# EAGLE schematic Rable (EAGLE 9.6.1)
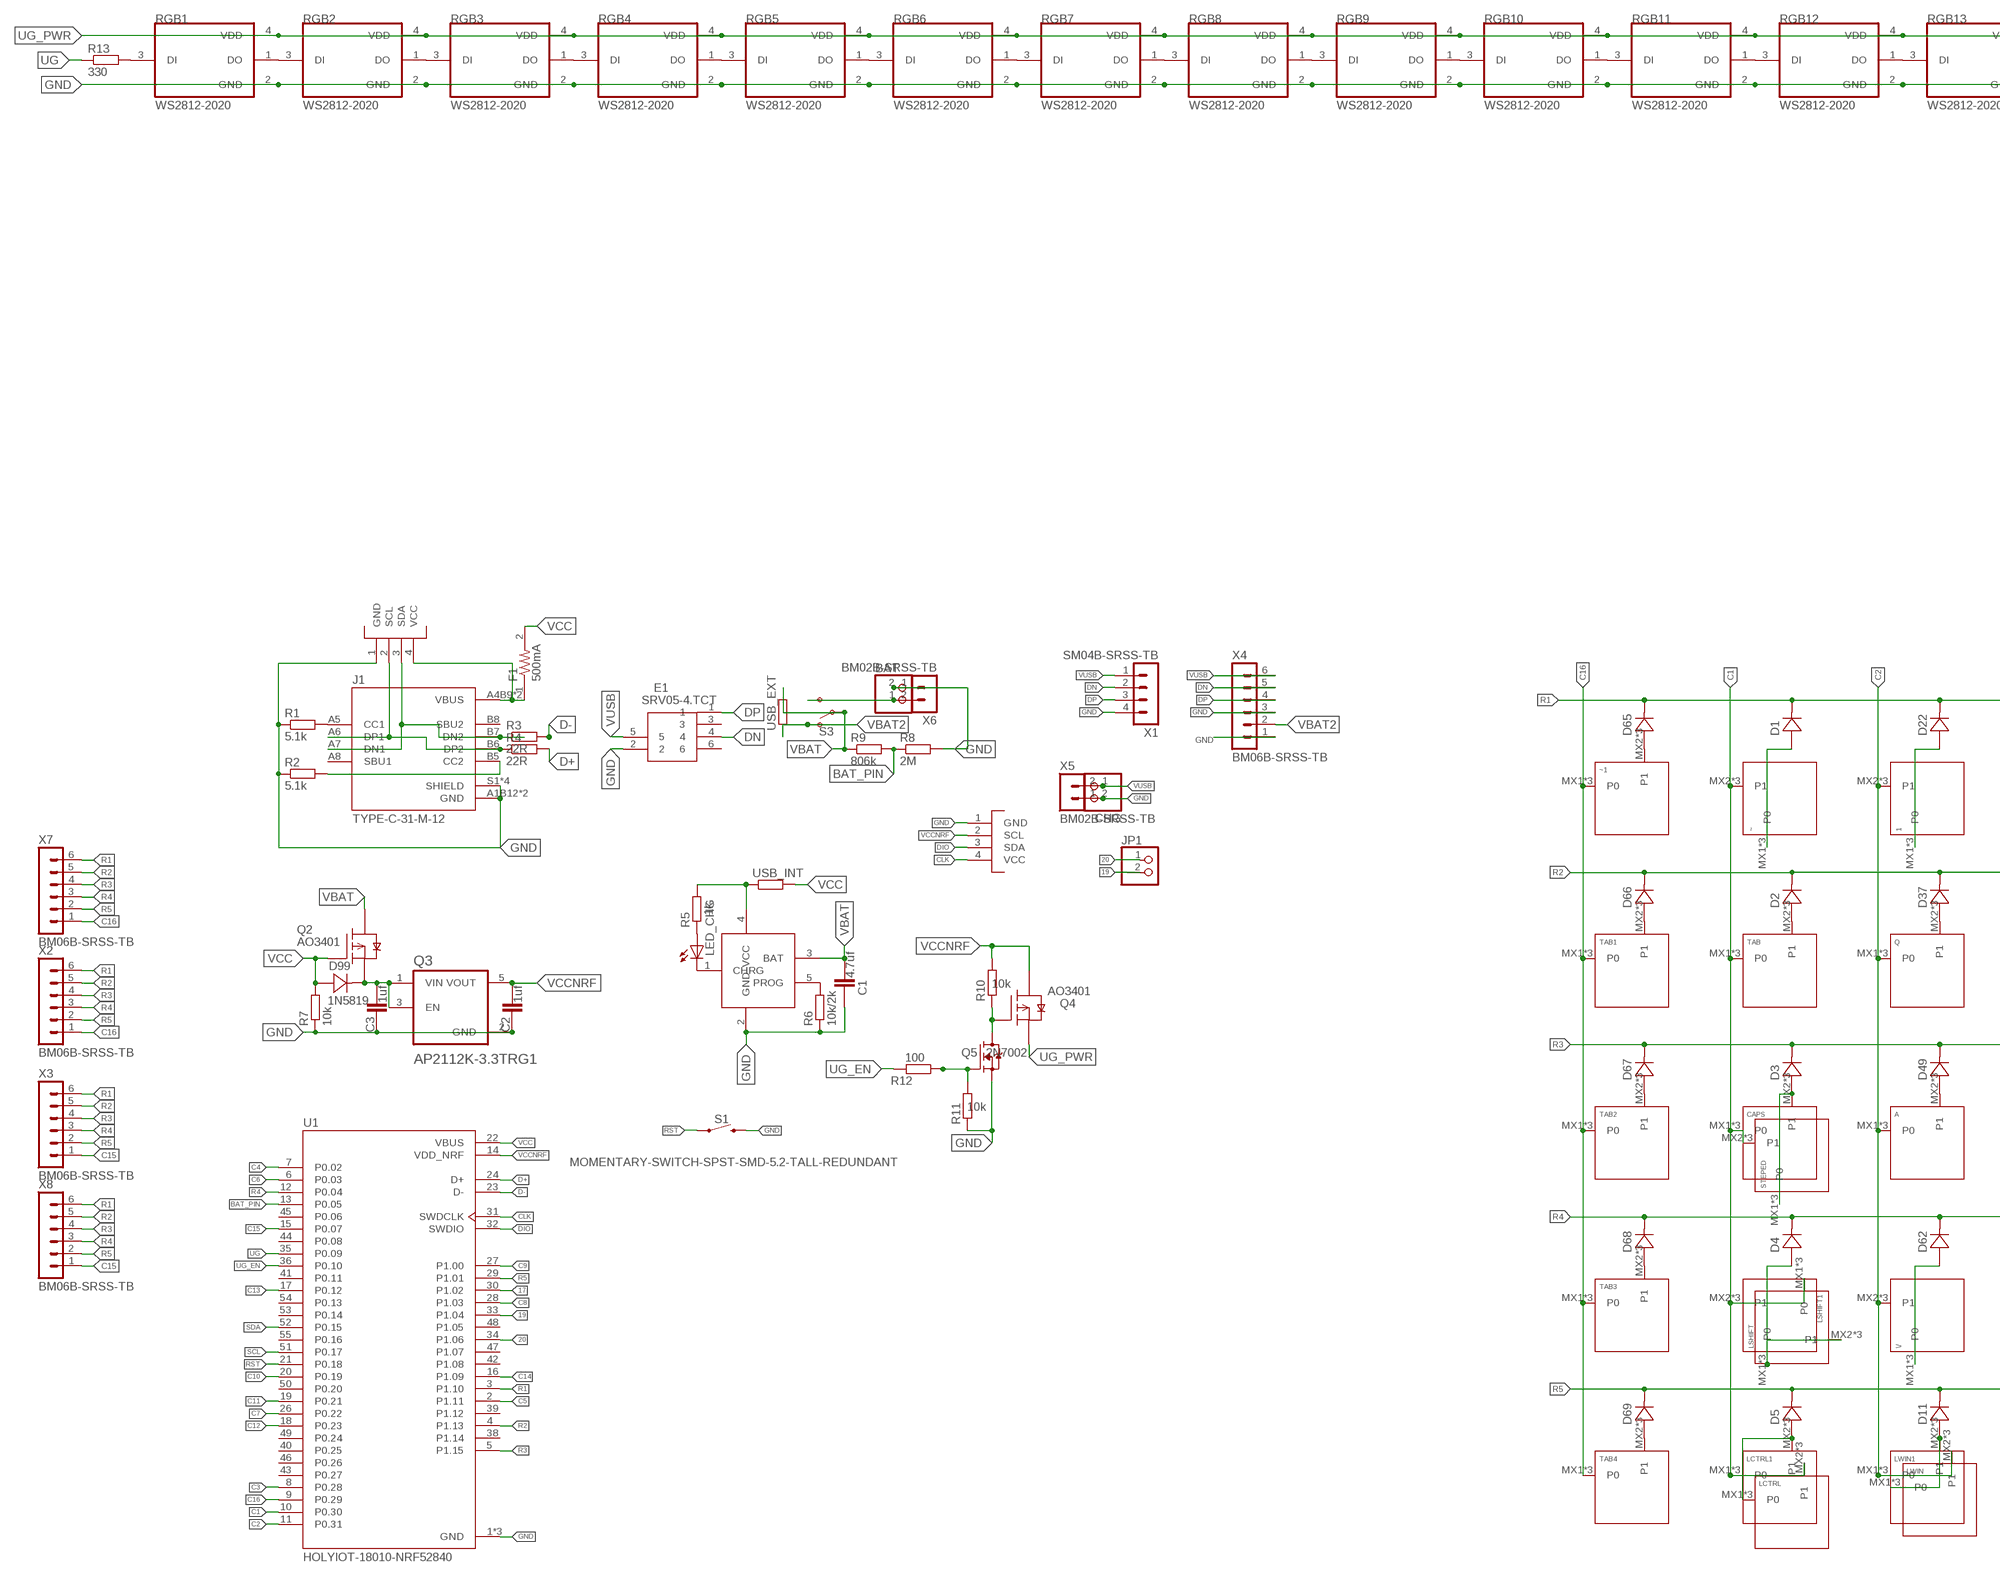
[diagram p0: schematic, sheet 1, part 1 of 2]
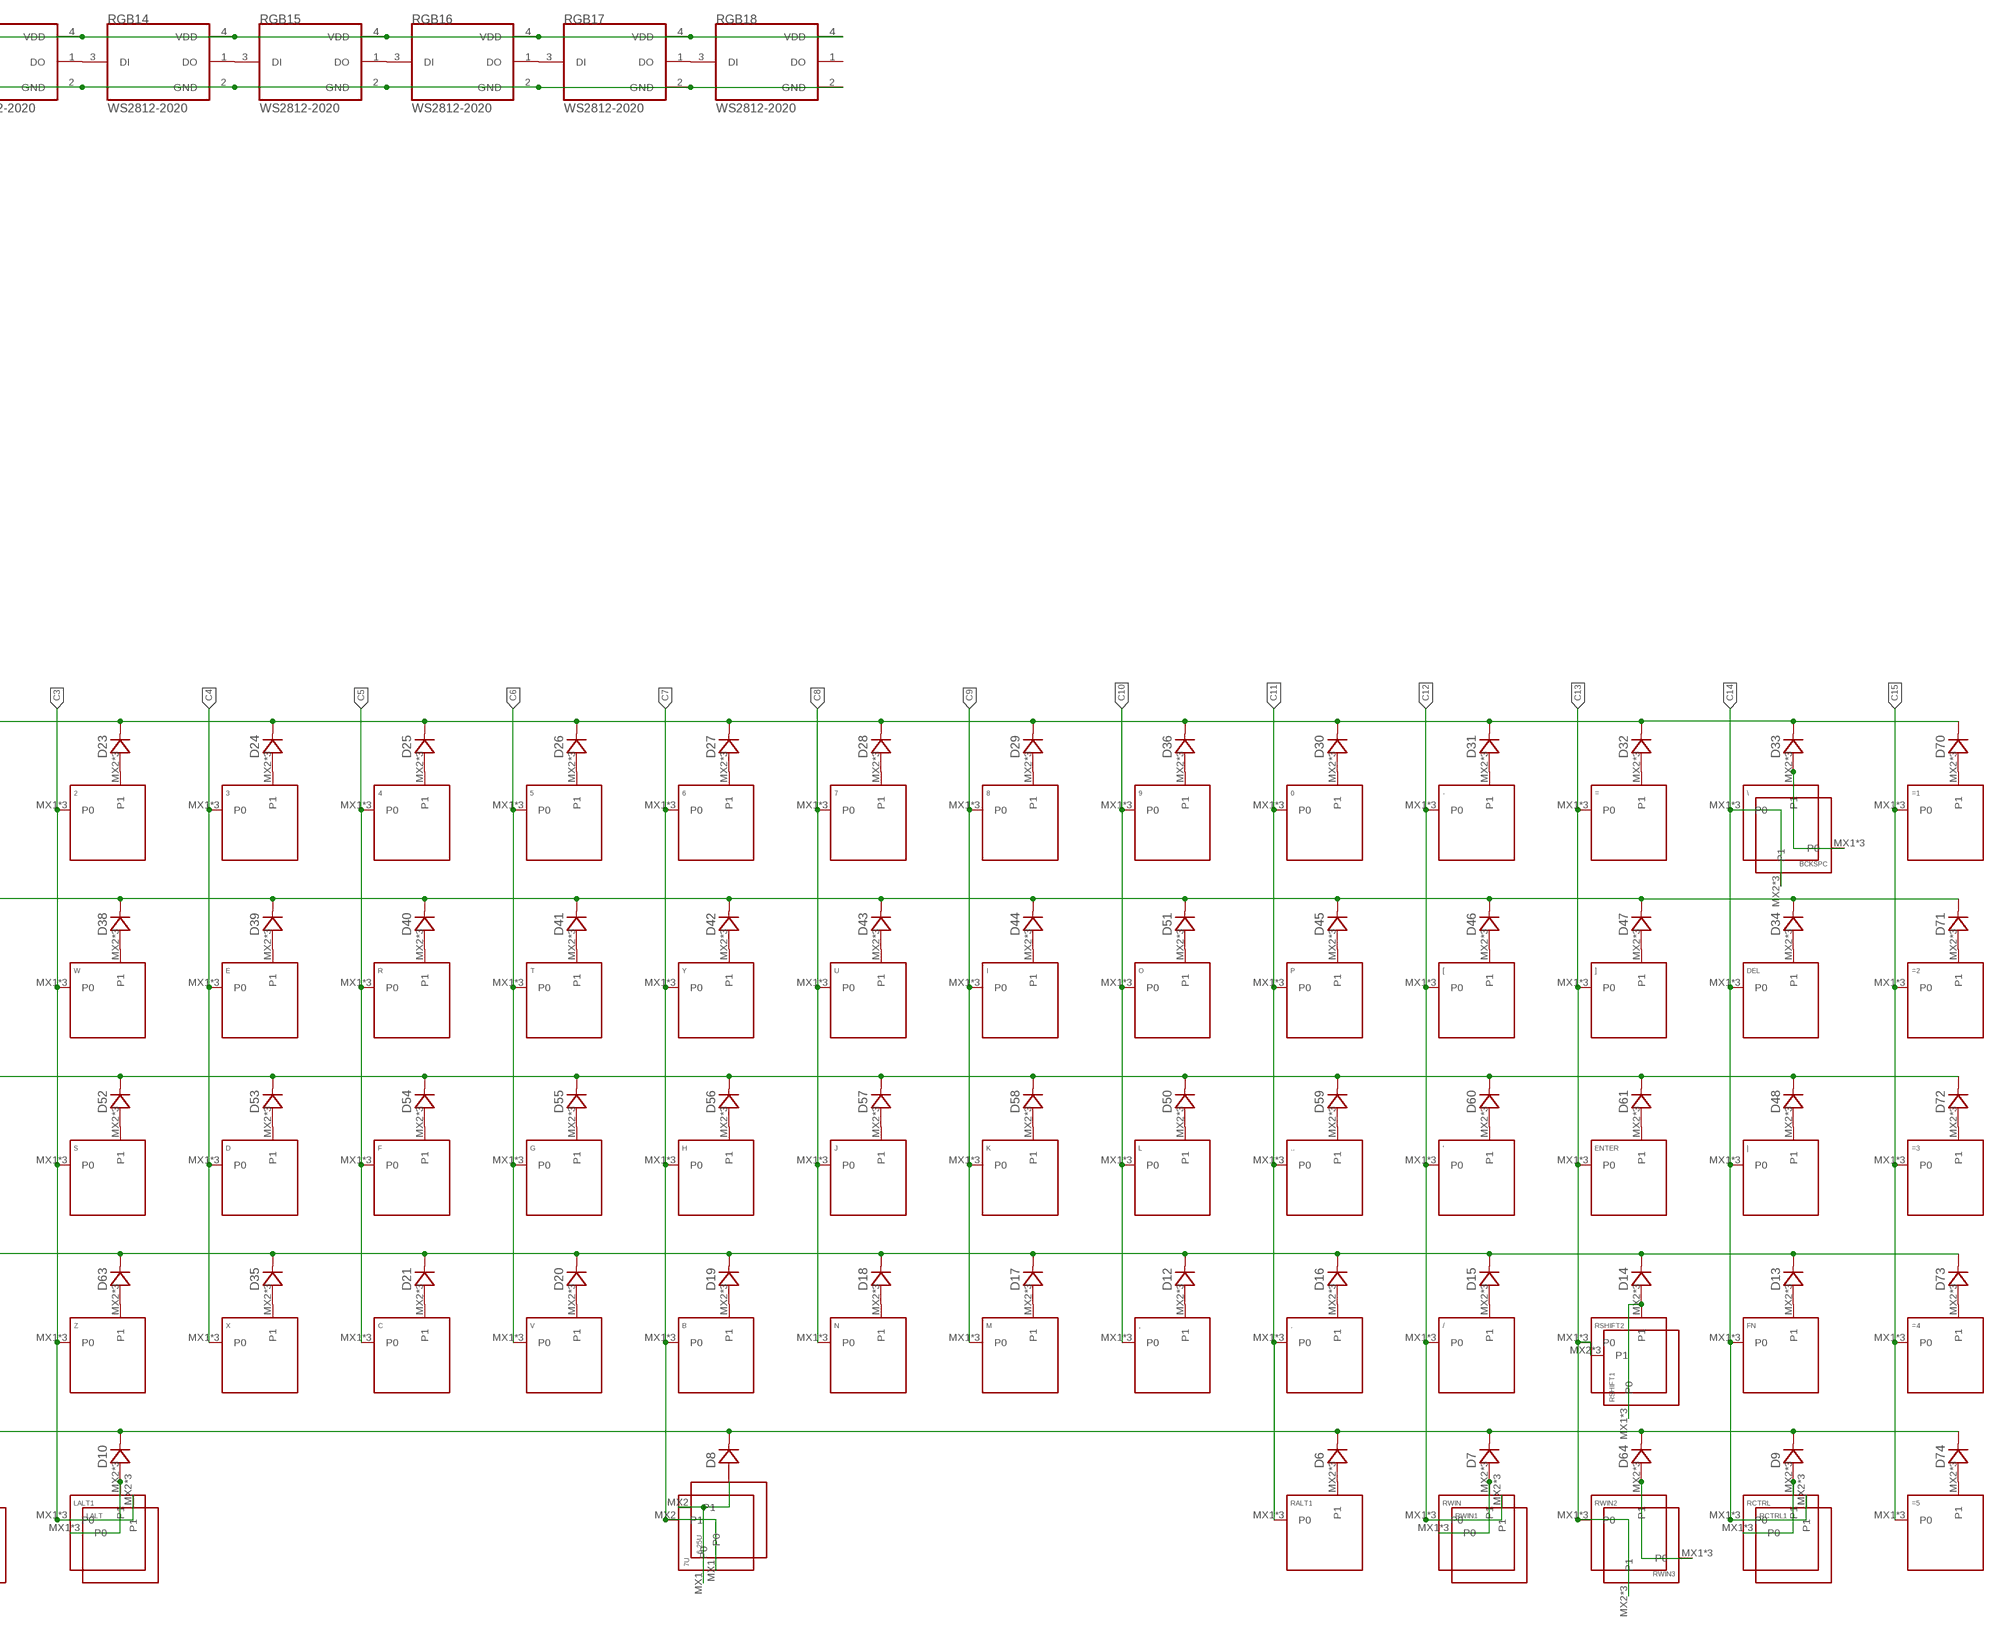
[diagram p1: schematic, sheet 1, part 2 of 2]

## Parts
0  KEYSWITCH-PLAIN-MXHSPCB-1U  [MXHSPCB-1U]
1  KEYSWITCH-PLAIN-MXHSPCB-1U  [MXHSPCB-1U]
2  KEYSWITCH-PLAIN-MXHSPCB-1U  [MXHSPCB-1U]
3  KEYSWITCH-PLAIN-MXHSPCB-1U  [MXHSPCB-1U]
4  KEYSWITCH-PLAIN-MXHSPCB-1U  [MXHSPCB-1U]
5  KEYSWITCH-PLAIN-MXHSPCB-1U  [MXHSPCB-1U]
6  KEYSWITCH-PLAIN-MXHSPCB-1U  [MXHSPCB-1U]
6.25U  KEYSWITCH-PLAIN-MXHSPCB-6.25U-FLIPPED  [MXHSPCB-6.25U-FLIPPED]
7  KEYSWITCH-PLAIN-MXHSPCB-1U  [MXHSPCB-1U]
7U  KEYSWITCH-PLAIN-MXHSPCB-7U  [MXHSPCB-7U]
8  KEYSWITCH-PLAIN-MXHSPCB-1U  [MXHSPCB-1U]
9  KEYSWITCH-PLAIN-MXHSPCB-1U  [MXHSPCB-1U]
'  KEYSWITCH-PLAIN-MXHSPCB-1U  [MXHSPCB-1U]
,  KEYSWITCH-PLAIN-MXHSPCB-1U  [MXHSPCB-1U]
-  KEYSWITCH-PLAIN-MXHSPCB-1U  [MXHSPCB-1U]
.  KEYSWITCH-PLAIN-MXHSPCB-1U  [MXHSPCB-1U]
..  KEYSWITCH-PLAIN-MXHSPCB-1U  [MXHSPCB-1U]
/  KEYSWITCH-PLAIN-MXHSPCB-1U  [MXHSPCB-1U]
=  KEYSWITCH-PLAIN-MXHSPCB-1U  [MXHSPCB-1U]
=1  KEYSWITCH-PLAIN-MXHSPCB-1U  [MXHSPCB-1U]
=2  KEYSWITCH-PLAIN-MXHSPCB-1U  [MXHSPCB-1U]
=3  KEYSWITCH-PLAIN-MXHSPCB-1U  [MXHSPCB-1U]
=4  KEYSWITCH-PLAIN-MXHSPCB-1U  [MXHSPCB-1U]
=5  KEYSWITCH-PLAIN-MXHSPCB-1U  [MXHSPCB-1U]
[  KEYSWITCH-PLAIN-MXHSPCB-1U  [MXHSPCB-1U]
\/  KEYSWITCH-PLAIN-MXHSPCB-1U  [MXHSPCB-1U]
\\  KEYSWITCH-PLAIN-MXHSPCB-1U  [MXHSPCB-1U]
]  KEYSWITCH-PLAIN-MXHSPCB-1U  [MXHSPCB-1U]
A  KEYSWITCH-PLAIN-MXHSPCB-1U  [MXHSPCB-1U]
B  KEYSWITCH-PLAIN-MXHSPCB-1U  [MXHSPCB-1U]
BAT  JST_2PIN-THM-RA  [JST-PH-2-THM-RA]
BCKSPC  KEYSWITCH-PLAIN-MXHSPCB-2U  [MXHSPCB-2U]
C  KEYSWITCH-PLAIN-MXHSPCB-1U  [MXHSPCB-1U]
C1  4.7uf  CAPACITOR-C0805  [C0805]
C2  1uf  CAPACITOR-C0805  [C0805]
C3  1uf  CAPACITOR-C0805  [C0805]
CAPS  KEYSWITCH-PLAIN-MXHSPCB-1U  [MXHSPCB-1U]
CHG  JST_2PIN-THM-RA  [JST-PH-2-THM-RA]
D  KEYSWITCH-PLAIN-MXHSPCB-1U  [MXHSPCB-1U]
D1  DIODE-SOD-123  [SOD-123]
D2  DIODE-SOD-123  [SOD-123]
D3  DIODE-SOD-123  [SOD-123]
D4  DIODE-SOD-123  [SOD-123]
D5  DIODE-SOD-123  [SOD-123]
D6  DIODE-SOD-123  [SOD-123]
D7  DIODE-SOD-123  [SOD-123]
D8  DIODE-SOD-123  [SOD-123]
D9  DIODE-SOD-123  [SOD-123]
D10  DIODE-SOD-123  [SOD-123]
D11  DIODE-SOD-123  [SOD-123]
D12  DIODE-SOD-123  [SOD-123]
D13  DIODE-SOD-123  [SOD-123]
D14  DIODE-SOD-123  [SOD-123]
D15  DIODE-SOD-123  [SOD-123]
D16  DIODE-SOD-123  [SOD-123]
D17  DIODE-SOD-123  [SOD-123]
D18  DIODE-SOD-123  [SOD-123]
D19  DIODE-SOD-123  [SOD-123]
D20  DIODE-SOD-123  [SOD-123]
D21  DIODE-SOD-123  [SOD-123]
D22  DIODE-SOD-123  [SOD-123]
D23  DIODE-SOD-123  [SOD-123]
D24  DIODE-SOD-123  [SOD-123]
D25  DIODE-SOD-123  [SOD-123]
D26  DIODE-SOD-123  [SOD-123]
D27  DIODE-SOD-123  [SOD-123]
D28  DIODE-SOD-123  [SOD-123]
D29  DIODE-SOD-123  [SOD-123]
D30  DIODE-SOD-123  [SOD-123]
D31  DIODE-SOD-123  [SOD-123]
D32  DIODE-SOD-123  [SOD-123]
D33  DIODE-SOD-123  [SOD-123]
D34  DIODE-SOD-123  [SOD-123]
D35  DIODE-SOD-123  [SOD-123]
D36  DIODE-SOD-123  [SOD-123]
D37  DIODE-SOD-123  [SOD-123]
D38  DIODE-SOD-123  [SOD-123]
D39  DIODE-SOD-123  [SOD-123]
D40  DIODE-SOD-123  [SOD-123]
D41  DIODE-SOD-123  [SOD-123]
D42  DIODE-SOD-123  [SOD-123]
D43  DIODE-SOD-123  [SOD-123]
D44  DIODE-SOD-123  [SOD-123]
D45  DIODE-SOD-123  [SOD-123]
D46  DIODE-SOD-123  [SOD-123]
D47  DIODE-SOD-123  [SOD-123]
D48  DIODE-SOD-123  [SOD-123]
D49  DIODE-SOD-123  [SOD-123]
D50  DIODE-SOD-123  [SOD-123]
D51  DIODE-SOD-123  [SOD-123]
D52  DIODE-SOD-123  [SOD-123]
D53  DIODE-SOD-123  [SOD-123]
D54  DIODE-SOD-123  [SOD-123]
D55  DIODE-SOD-123  [SOD-123]
D56  DIODE-SOD-123  [SOD-123]
D57  DIODE-SOD-123  [SOD-123]
D58  DIODE-SOD-123  [SOD-123]
D59  DIODE-SOD-123  [SOD-123]
D60  DIODE-SOD-123  [SOD-123]
D61  DIODE-SOD-123  [SOD-123]
D62  DIODE-SOD-123  [SOD-123]
D63  DIODE-SOD-123  [SOD-123]
D64  DIODE-SOD-123  [SOD-123]
D65  DIODE-SOD-123  [SOD-123]
D66  DIODE-SOD-123  [SOD-123]
D67  DIODE-SOD-123  [SOD-123]
D68  DIODE-SOD-123  [SOD-123]
D69  DIODE-SOD-123  [SOD-123]
D70  DIODE-SOD-123  [SOD-123]
D71  DIODE-SOD-123  [SOD-123]
D72  DIODE-SOD-123  [SOD-123]
D73  DIODE-SOD-123  [SOD-123]
D74  DIODE-SOD-123  [SOD-123]
D99  1N5819  DIODE-SOD-123  [SOD-123]
DEL  KEYSWITCH-PLAIN-MXHSPCB-1U  [MXHSPCB-1U]
E  KEYSWITCH-PLAIN-MXHSPCB-1U  [MXHSPCB-1U]
E1  SRV05-4.TCT  [SOT95P280X145-6N]
ENTER  KEYSWITCH-PLAIN-MXHSPCB-2U-FLIPPED  [MXHSPCB-2U-FLIPPED]
F  KEYSWITCH-PLAIN-MXHSPCB-1U  [MXHSPCB-1U]
F1  500mA  0ZCJ0075AF2E  [RESC3216X125N]
FN  KEYSWITCH-PLAIN-MXHSPCB-1U  [MXHSPCB-1U]
G  KEYSWITCH-PLAIN-MXHSPCB-1U  [MXHSPCB-1U]
H  KEYSWITCH-PLAIN-MXHSPCB-1U  [MXHSPCB-1U]
I  KEYSWITCH-PLAIN-MXHSPCB-1U  [MXHSPCB-1U]
J  KEYSWITCH-PLAIN-MXHSPCB-1U  [MXHSPCB-1U]
J1  TYPE-C-31-M-12  [HRO_TYPE-C-31-M-12]
J3  I2C-HEADER  [HEADER-4X1-2.54]
J4  I2C-HEADER  [HEADER-4X1-2.54]
JP1  PINHD-1X2M  [1X02M]
K  KEYSWITCH-PLAIN-MXHSPCB-1U  [MXHSPCB-1U]
L  KEYSWITCH-PLAIN-MXHSPCB-1U  [MXHSPCB-1U]
LALT  KEYSWITCH-PLAIN-MXHSPCB-1U  [MXHSPCB-1U]
LALT1  KEYSWITCH-PLAIN-MXHSPCB-1U  [MXHSPCB-1U]
LCTRL  KEYSWITCH-PLAIN-MXHSPCB-1U  [MXHSPCB-1U]
LCTRL1  KEYSWITCH-PLAIN-MXHSPCB-1U  [MXHSPCB-1U]
LED_CHG  LEDCHIPLED_1206  [CHIPLED_1206]
LSHIFT  KEYSWITCH-PLAIN-MXHSPCB-1U  [MXHSPCB-1U]
LSHIFT1  KEYSWITCH-PLAIN-MXHSPCB-2U  [MXHSPCB-2U]
LWIN  KEYSWITCH-PLAIN-MXHSPCB-1U  [MXHSPCB-1U]
LWIN1  KEYSWITCH-PLAIN-MXHSPCB-1U  [MXHSPCB-1U]
M  KEYSWITCH-PLAIN-MXHSPCB-1U  [MXHSPCB-1U]
N  KEYSWITCH-PLAIN-MXHSPCB-1U  [MXHSPCB-1U]
O  KEYSWITCH-PLAIN-MXHSPCB-1U  [MXHSPCB-1U]
P  KEYSWITCH-PLAIN-MXHSPCB-1U  [MXHSPCB-1U]
Q  KEYSWITCH-PLAIN-MXHSPCB-1U  [MXHSPCB-1U]
Q1  LTC4054  [LTC4054]
Q2  AO3401  [SOT23-3]
Q3  AP2112K-3.3TRG1  [SOT95P285X140-5N]
Q4  AO3401  [SOT23-3]
Q5  2N7002  [SOT95P240X111-3N]
R  KEYSWITCH-PLAIN-MXHSPCB-1U  [MXHSPCB-1U]
R1  5.1k  RESISTOR-0805  [R0805]
R2  5.1k  RESISTOR-0805  [R0805]
R3  22R  RESISTOR-0805  [R0805]
R4  22R  RESISTOR-0805  [R0805]
R5  1k  RESISTOR-0805  [R0805]
R6  10k/2k  RESISTOR-0805  [R0805]
R7  10k  RESISTOR-0805  [R0805]
R8  2M  RESISTOR-0805  [R0805]
R9  806k  RESISTOR-0805  [R0805]
R10  10k  RESISTOR-0805  [R0805]
R11  10k  RESISTOR-0805  [R0805]
R12  100  RESISTOR-0805  [R0805]
R13  330  RESISTOR-0805  [R0805]
RALT1  KEYSWITCH-PLAIN-MXHSPCB-1U  [MXHSPCB-1U]
RCTRL  KEYSWITCH-PLAIN-MXHSPCB-1U  [MXHSPCB-1U]
RCTRL1  KEYSWITCH-PLAIN-MXHSPCB-1U  [MXHSPCB-1U]
RGB1  WS2812-2020  [LED_WS2812-2020]
RGB2  WS2812-2020  [LED_WS2812-2020]
RGB3  WS2812-2020  [LED_WS2812-2020]
RGB4  WS2812-2020  [LED_WS2812-2020]
RGB5  WS2812-2020  [LED_WS2812-2020]
RGB6  WS2812-2020  [LED_WS2812-2020]
RGB7  WS2812-2020  [LED_WS2812-2020]
RGB8  WS2812-2020  [LED_WS2812-2020]
RGB9  WS2812-2020  [LED_WS2812-2020]
RGB10  WS2812-2020  [LED_WS2812-2020]
RGB11  WS2812-2020  [LED_WS2812-2020]
RGB12  WS2812-2020  [LED_WS2812-2020]
RGB13  WS2812-2020  [LED_WS2812-2020]
RGB14  WS2812-2020  [LED_WS2812-2020]
RGB15  WS2812-2020  [LED_WS2812-2020]
RGB16  WS2812-2020  [LED_WS2812-2020]
RGB17  WS2812-2020  [LED_WS2812-2020]
RGB18  WS2812-2020  [LED_WS2812-2020]
RSHIFT1  KEYSWITCH-PLAIN-MXHSPCB-2U-FLIPPED  [MXHSPCB-2U-FLIPPED]
RSHIFT2  KEYSWITCH-PLAIN-MXHSPCB-1U  [MXHSPCB-1U]
RWIN  KEYSWITCH-PLAIN-MXHSPCB-1U  [MXHSPCB-1U]
RWIN1  KEYSWITCH-PLAIN-MXHSPCB-1U  [MXHSPCB-1U]
RWIN2  KEYSWITCH-PLAIN-MXHSPCB-1U  [MXHSPCB-1U]
RWIN3  KEYSWITCH-PLAIN-MXHSPCB-1U  [MXHSPCB-1U]
S  KEYSWITCH-PLAIN-MXHSPCB-1U  [MXHSPCB-1U]
S1  MOMENTARY-SWITCH-SPST-SMD-5.2-TALL-REDUNDANT  [TACTILE_SWITCH_SMD_5.2MM]
S3  SWITCH-SPDT-SMD-AYZ0202  [SWITCH_DPDT_SMD_AYZ0202]
STEPED  KEYSWITCH-PLAIN-MXHSPCB-1U  [MXHSPCB-1U]
T  KEYSWITCH-PLAIN-MXHSPCB-1U  [MXHSPCB-1U]
TAB  KEYSWITCH-PLAIN-MXHSPCB-1U  [MXHSPCB-1U]
TAB1  KEYSWITCH-PLAIN-MXHSPCB-1U  [MXHSPCB-1U]
TAB2  KEYSWITCH-PLAIN-MXHSPCB-1U  [MXHSPCB-1U]
TAB3  KEYSWITCH-PLAIN-MXHSPCB-1U  [MXHSPCB-1U]
TAB4  KEYSWITCH-PLAIN-MXHSPCB-1U  [MXHSPCB-1U]
U  KEYSWITCH-PLAIN-MXHSPCB-1U  [MXHSPCB-1U]
U1  HOLYIOT-18010-NRF52840  [XCVR_HOLYIOT-18010-NRF52840]
USB_EXT  RESISTOR-0405  [R0402]
USB_INT  RESISTOR-0405  [R0402]
V  KEYSWITCH-PLAIN-MXHSPCB-1U  [MXHSPCB-1U]
W  KEYSWITCH-PLAIN-MXHSPCB-1U  [MXHSPCB-1U]
X  KEYSWITCH-PLAIN-MXHSPCB-1U  [MXHSPCB-1U]
X1  SM04B-SRSS-TB  [SM04B-SRSS-TB]
X2  BM06B-SRSS-TB  [BM06B-SRSS-TB]
X3  BM06B-SRSS-TB  [BM06B-SRSS-TB]
X4  BM06B-SRSS-TB  [BM06B-SRSS-TB]
X5  BM02B-SRSS-TB  [BM02B-SRSS-TB]
X6  BM02B-SRSS-TB  [BM02B-SRSS-TB]
X7  BM06B-SRSS-TB  [BM06B-SRSS-TB]
X8  BM06B-SRSS-TB  [BM06B-SRSS-TB]
Y  KEYSWITCH-PLAIN-MXHSPCB-1U  [MXHSPCB-1U]
Z  KEYSWITCH-PLAIN-MXHSPCB-1U  [MXHSPCB-1U]
|  KEYSWITCH-PLAIN-MXHSPCB-1U  [MXHSPCB-1U]
~  KEYSWITCH-PLAIN-MXHSPCB-1U  [MXHSPCB-1U]
~1  KEYSWITCH-PLAIN-MXHSPCB-1U  [MXHSPCB-1U]

## Nets
17: U1.30(P1.02)
19: JP1.2 U1.33(P1.04)
20: JP1.1 U1.34(P1.06)
BAT_PIN: R8.1 R9.2 U1.13(P0.05)
C1: CAPS.MX1(P0) CAPS.P$1(P0) CAPS.P$2(P0) LCTRL1.MX1(P0) LCTRL1.P$1(P0) LCTRL1.P$2(P0) LCTRL.MX2(P1) LCTRL.P$3(P1) LCTRL.P$4(P1) LSHIFT1.MX1(P0) LSHIFT1.P$1(P0) LSHIFT1.P$2(P0) LSHIFT.MX2(P1) LSHIFT.P$3(P1) LSHIFT.P$4(P1) STEPED.MX2(P1) STEPED.P$3(P1) STEPED.P$4(P1) TAB.MX1(P0) TAB.P$1(P0) TAB.P$2(P0) U1.10(P0.30) ~.MX2(P1) ~.P$3(P1) ~.P$4(P1)
C2: 1.MX2(P1) 1.P$3(P1) 1.P$4(P1) \/.MX2(P1) \/.P$3(P1) \/.P$4(P1) A.MX1(P0) A.P$1(P0) A.P$2(P0) LWIN1.MX1(P0) LWIN1.P$1(P0) LWIN1.P$2(P0) LWIN.MX2(P1) LWIN.P$3(P1) LWIN.P$4(P1) Q.MX1(P0) Q.P$1(P0) Q.P$2(P0) U1.11(P0.31)
C3: 2.MX1(P0) 2.P$1(P0) 2.P$2(P0) LALT1.MX1(P0) LALT1.P$1(P0) LALT1.P$2(P0) LALT.MX2(P1) LALT.P$3(P1) LALT.P$4(P1) S.MX1(P0) S.P$1(P0) S.P$2(P0) U1.8(P0.28) W.MX1(P0) W.P$1(P0) W.P$2(P0) Z.MX1(P0) Z.P$1(P0) Z.P$2(P0)
C4: 3.MX1(P0) 3.P$1(P0) 3.P$2(P0) D.MX1(P0) D.P$1(P0) D.P$2(P0) E.MX1(P0) E.P$1(P0) E.P$2(P0) U1.7(P0.02) X.MX1(P0) X.P$1(P0) X.P$2(P0)
C5: 4.MX1(P0) 4.P$1(P0) 4.P$2(P0) C.MX1(P0) C.P$1(P0) C.P$2(P0) F.MX1(P0) F.P$1(P0) F.P$2(P0) R.MX1(P0) R.P$1(P0) R.P$2(P0) U1.2(P1.11)
C6: 5.MX1(P0) 5.P$1(P0) 5.P$2(P0) G.MX1(P0) G.P$1(P0) G.P$2(P0) T.MX1(P0) T.P$1(P0) T.P$2(P0) U1.6(P0.03) V.MX1(P0) V.P$1(P0) V.P$2(P0)
C7: 6.25U.MX1(P0) 6.MX1(P0) 6.P$1(P0) 6.P$2(P0) 7U.MX2(P1) B.MX1(P0) B.P$1(P0) B.P$2(P0) H.MX1(P0) H.P$1(P0) H.P$2(P0) U1.26(P0.22) Y.MX1(P0) Y.P$1(P0) Y.P$2(P0)
C8: 7.MX1(P0) 7.P$1(P0) 7.P$2(P0) J.MX1(P0) J.P$1(P0) J.P$2(P0) N.MX1(P0) N.P$1(P0) N.P$2(P0) U1.28(P1.03) U.MX1(P0) U.P$1(P0) U.P$2(P0)
C9: 8.MX1(P0) 8.P$1(P0) 8.P$2(P0) I.MX1(P0) I.P$1(P0) I.P$2(P0) K.MX1(P0) K.P$1(P0) K.P$2(P0) M.MX1(P0) M.P$1(P0) M.P$2(P0) U1.27(P1.00)
C10: 9.MX1(P0) 9.P$1(P0) 9.P$2(P0) ,.MX1(P0) ,.P$1(P0) ,.P$2(P0) L.MX1(P0) L.P$1(P0) L.P$2(P0) O.MX1(P0) O.P$1(P0) O.P$2(P0) U1.20(P0.19)
C11: 0.MX1(P0) 0.P$1(P0) 0.P$2(P0) ...MX1(P0) ...P$1(P0) ...P$2(P0) ..MX1(P0) ..P$1(P0) ..P$2(P0) P.MX1(P0) P.P$1(P0) P.P$2(P0) RALT1.MX1(P0) RALT1.P$1(P0) RALT1.P$2(P0) U1.19(P0.21)
C12: '.MX1(P0) '.P$1(P0) '.P$2(P0) -.MX1(P0) -.P$1(P0) -.P$2(P0) /.MX1(P0) /.P$1(P0) /.P$2(P0) [.MX1(P0) [.P$1(P0) [.P$2(P0) RWIN1.MX2(P1) RWIN1.P$3(P1) RWIN1.P$4(P1) RWIN.MX1(P0) RWIN.P$1(P0) RWIN.P$2(P0) U1.18(P0.23)
C13: =.MX1(P0) =.P$1(P0) =.P$2(P0) ].MX1(P0) ].P$1(P0) ].P$2(P0) ENTER.MX1(P0) ENTER.P$1(P0) ENTER.P$2(P0) RSHIFT1.MX2(P1) RSHIFT1.P$3(P1) RSHIFT1.P$4(P1) RSHIFT2.MX1(P0) RSHIFT2.P$1(P0) RSHIFT2.P$2(P0) RWIN2.MX1(P0) RWIN2.P$1(P0) RWIN2.P$2(P0) RWIN3.MX2(P1) RWIN3.P$3(P1) RWIN3.P$4(P1) U1.17(P0.12)
C14: \\.MX1(P0) \\.P$1(P0) \\.P$2(P0) BCKSPC.MX2(P1) BCKSPC.P$3(P1) BCKSPC.P$4(P1) DEL.MX1(P0) DEL.P$1(P0) DEL.P$2(P0) FN.MX1(P0) FN.P$1(P0) FN.P$2(P0) RCTRL1.MX2(P1) RCTRL1.P$3(P1) RCTRL1.P$4(P1) RCTRL.MX1(P0) RCTRL.P$1(P0) RCTRL.P$2(P0) U1.16(P1.09) |.MX1(P0) |.P$1(P0) |.P$2(P0)
C15: =1.MX1(P0) =1.P$1(P0) =1.P$2(P0) =2.MX1(P0) =2.P$1(P0) =2.P$2(P0) =3.MX1(P0) =3.P$1(P0) =3.P$2(P0) =4.MX1(P0) =4.P$1(P0) =4.P$2(P0) =5.MX1(P0) =5.P$1(P0) =5.P$2(P0) U1.15(P0.07) X3.1 X8.1
C16: TAB1.MX1(P0) TAB1.P$1(P0) TAB1.P$2(P0) TAB2.MX1(P0) TAB2.P$1(P0) TAB2.P$2(P0) TAB3.MX1(P0) TAB3.P$1(P0) TAB3.P$2(P0) TAB4.MX1(P0) TAB4.P$1(P0) TAB4.P$2(P0) U1.9(P0.29) X2.1 X7.1 ~1.MX1(P0) ~1.P$1(P0) ~1.P$2(P0)
CLK: J3.4(VCC) U1.31(SWDCLK)
D+: R4.2 U1.24(D+)
D-: R3.2 U1.23(D-)
DIO: J3.3(SDA) U1.32(SWDIO)
DN: E1.4 J1.A7(DN1) J1.B7(DN2) J4.3(SDA) R3.1 X1.2 X4.5
DP: E1.1 J1.A6(DP1) J1.B6(DP2) J4.2(SCL) R4.1 X1.3 X4.4
GND: BAT.2 C1.1 C2.1 C3.1 CHG.2 E1.2 J1.A1B12(GND) J1.B1A12(GND) J1.S1(SHIELD) J1.S2(SHIELD) J1.S3(SHIELD) J1.S4(SHIELD) J3.1(GND) J4.1(GND) Q1.2(GND) Q3.2(GND) Q5.2(S) R1.1 R2.1 R6.1 R7.1 R8.2 R11.1 RGB1.2(GND) RGB2.2(GND) RGB3.2(GND) RGB4.2(GND) RGB5.2(GND) RGB6.2(GND) RGB7.2(GND) RGB8.2(GND) RGB9.2(GND) RGB10.2(GND) RGB11.2(GND) RGB12.2(GND) RGB13.2(GND) RGB14.2(GND) RGB15.2(GND) RGB16.2(GND) RGB17.2(GND) RGB18.2(GND) S1.3 S1.4 U1.1(GND) U1.25(GND) U1.37(GND) X1.4 X4.1 X4.3 X5.1 X6.1
N$1: 6.25U.MX2(P1) 7U.MX1(P0) D8.A
N$2: D1.A ~.MX1(P0) ~.P$1(P0) ~.P$2(P0)
N$3: D2.A TAB.MX2(P1) TAB.P$3(P1) TAB.P$4(P1)
N$4: CAPS.MX2(P1) CAPS.P$3(P1) CAPS.P$4(P1) D3.A STEPED.MX1(P0) STEPED.P$1(P0) STEPED.P$2(P0)
N$5: \/.MX1(P0) \/.P$1(P0) \/.P$2(P0) D62.A
N$6: D5.A LCTRL1.MX2(P1) LCTRL1.P$3(P1) LCTRL1.P$4(P1) LCTRL.MX1(P0) LCTRL.P$1(P0) LCTRL.P$2(P0)
N$7: LED_CHG.C Q1.1(CHRG)
N$8: D14.A RSHIFT1.MX1(P0) RSHIFT1.P$1(P0) RSHIFT1.P$2(P0) RSHIFT2.MX2(P1) RSHIFT2.P$3(P1) RSHIFT2.P$4(P1)
N$9: LED_CHG.A R5.1
N$10: C3.2 D99.C Q2.2(S) Q3.1(VIN) Q3.3(EN)
N$11: D64.A RWIN2.MX2(P1) RWIN2.P$3(P1) RWIN2.P$4(P1) RWIN3.MX1(P0) RWIN3.P$1(P0) RWIN3.P$2(P0)
N$12: D11.A LWIN1.MX2(P1) LWIN1.P$3(P1) LWIN1.P$4(P1) LWIN.MX1(P0) LWIN.P$1(P0) LWIN.P$2(P0)
N$13: D10.A LALT1.MX2(P1) LALT1.P$3(P1) LALT1.P$4(P1) LALT.MX1(P0) LALT.P$1(P0) LALT.P$2(P0)
N$14: D13.A FN.MX2(P1) FN.P$3(P1) FN.P$4(P1)
N$15: D65.A ~1.MX2(P1) ~1.P$3(P1) ~1.P$4(P1)
N$16: D66.A TAB1.MX2(P1) TAB1.P$3(P1) TAB1.P$4(P1)
N$17: D67.A TAB2.MX2(P1) TAB2.P$3(P1) TAB2.P$4(P1)
N$18: \\.MX2(P1) \\.P$3(P1) \\.P$4(P1) BCKSPC.MX1(P0) BCKSPC.P$1(P0) BCKSPC.P$2(P0) D33.A
N$19: D68.A TAB3.MX2(P1) TAB3.P$3(P1) TAB3.P$4(P1)
N$20: D69.A TAB4.MX2(P1) TAB4.P$3(P1) TAB4.P$4(P1)
N$21: =1.MX2(P1) =1.P$3(P1) =1.P$4(P1) D70.A
N$22: D6.A RALT1.MX2(P1) RALT1.P$3(P1) RALT1.P$4(P1)
N$23: =2.MX2(P1) =2.P$3(P1) =2.P$4(P1) D71.A
N$24: 1.MX1(P0) 1.P$1(P0) 1.P$2(P0) D22.A
N$25: 2.MX2(P1) 2.P$3(P1) 2.P$4(P1) D23.A
N$26: 3.MX2(P1) 3.P$3(P1) 3.P$4(P1) D24.A
N$27: 4.MX2(P1) 4.P$3(P1) 4.P$4(P1) D25.A
N$28: 5.MX2(P1) 5.P$3(P1) 5.P$4(P1) D26.A
N$29: 6.MX2(P1) 6.P$3(P1) 6.P$4(P1) D27.A
N$30: 7.MX2(P1) 7.P$3(P1) 7.P$4(P1) D28.A
N$31: 8.MX2(P1) 8.P$3(P1) 8.P$4(P1) D29.A
N$32: 0.MX2(P1) 0.P$3(P1) 0.P$4(P1) D30.A
N$33: -.MX2(P1) -.P$3(P1) -.P$4(P1) D31.A
N$34: =.MX2(P1) =.P$3(P1) =.P$4(P1) D32.A
N$35: =3.MX2(P1) =3.P$3(P1) =3.P$4(P1) D72.A
N$36: D34.A DEL.MX2(P1) DEL.P$3(P1) DEL.P$4(P1)
N$37: =4.MX2(P1) =4.P$3(P1) =4.P$4(P1) D73.A
N$38: 9.MX2(P1) 9.P$3(P1) 9.P$4(P1) D36.A
N$39: D37.A Q.MX2(P1) Q.P$3(P1) Q.P$4(P1)
N$40: D38.A W.MX2(P1) W.P$3(P1) W.P$4(P1)
N$41: D39.A E.MX2(P1) E.P$3(P1) E.P$4(P1)
N$42: D40.A R.MX2(P1) R.P$3(P1) R.P$4(P1)
N$43: D41.A T.MX2(P1) T.P$3(P1) T.P$4(P1)
N$44: D42.A Y.MX2(P1) Y.P$3(P1) Y.P$4(P1)
N$45: D43.A U.MX2(P1) U.P$3(P1) U.P$4(P1)
N$46: D9.A RCTRL1.MX1(P0) RCTRL1.P$1(P0) RCTRL1.P$2(P0) RCTRL.MX2(P1) RCTRL.P$3(P1) RCTRL.P$4(P1)
N$47: =5.MX2(P1) =5.P$3(P1) =5.P$4(P1) D74.A
N$51: Q5.1(G) R11.2 R12.1
N$53: Q4.1(G) Q5.3(D) R10.1
N$54: D44.A I.MX2(P1) I.P$3(P1) I.P$4(P1)
N$55: D51.A O.MX2(P1) O.P$3(P1) O.P$4(P1)
N$56: D45.A P.MX2(P1) P.P$3(P1) P.P$4(P1)
N$57: [.MX2(P1) [.P$3(P1) [.P$4(P1) D46.A
N$58: ].MX2(P1) ].P$3(P1) ].P$4(P1) D47.A
N$59: D4.A LSHIFT1.MX2(P1) LSHIFT1.P$3(P1) LSHIFT1.P$4(P1) LSHIFT.MX1(P0) LSHIFT.P$1(P0) LSHIFT.P$2(P0)
N$60: D48.A |.MX2(P1) |.P$3(P1) |.P$4(P1)
N$62: A.MX2(P1) A.P$3(P1) A.P$4(P1) D49.A
N$63: D52.A S.MX2(P1) S.P$3(P1) S.P$4(P1)
N$64: D53.A D.MX2(P1) D.P$3(P1) D.P$4(P1)
N$65: D54.A F.MX2(P1) F.P$3(P1) F.P$4(P1)
N$66: D55.A G.MX2(P1) G.P$3(P1) G.P$4(P1)
N$69: D56.A H.MX2(P1) H.P$3(P1) H.P$4(P1)
N$70: D57.A J.MX2(P1) J.P$3(P1) J.P$4(P1)
N$71: D58.A K.MX2(P1) K.P$3(P1) K.P$4(P1)
N$72: D50.A L.MX2(P1) L.P$3(P1) L.P$4(P1)
N$73: ...MX2(P1) ...P$3(P1) ...P$4(P1) D59.A
N$77: '.MX2(P1) '.P$3(P1) '.P$4(P1) D60.A
N$78: D61.A ENTER.MX2(P1) ENTER.P$3(P1) ENTER.P$4(P1)
N$80: RGB17.1(DO) RGB18.3(DI)
N$81: RGB16.1(DO) RGB17.3(DI)
N$82: BAT.1 S3.3(S) X6.2
N$83: J1.A5(CC1) R1.2
N$85: J1.B5(CC2) R2.2
N$87: Q1.5(PROG) R6.2
N$88: D63.A Z.MX2(P1) Z.P$3(P1) Z.P$4(P1)
N$89: D35.A X.MX2(P1) X.P$3(P1) X.P$4(P1)
N$90: C.MX2(P1) C.P$3(P1) C.P$4(P1) D21.A
N$91: D20.A V.MX2(P1) V.P$3(P1) V.P$4(P1)
N$92: B.MX2(P1) B.P$3(P1) B.P$4(P1) D19.A
N$93: D18.A N.MX2(P1) N.P$3(P1) N.P$4(P1)
N$94: D17.A M.MX2(P1) M.P$3(P1) M.P$4(P1)
N$95: ,.MX2(P1) ,.P$3(P1) ,.P$4(P1) D12.A
N$96: ..MX2(P1) ..P$3(P1) ..P$4(P1) D16.A
N$97: /.MX2(P1) /.P$3(P1) /.P$4(P1) D15.A
N$98: RGB1.1(DO) RGB2.3(DI)
N$102: RGB2.1(DO) RGB3.3(DI)
N$103: D7.A RWIN1.MX1(P0) RWIN1.P$1(P0) RWIN1.P$2(P0) RWIN.MX2(P1) RWIN.P$3(P1) RWIN.P$4(P1)
N$104: RGB3.1(DO) RGB4.3(DI)
N$105: RGB4.1(DO) RGB5.3(DI)
N$106: RGB5.1(DO) RGB6.3(DI)
N$107: RGB6.1(DO) RGB7.3(DI)
N$108: RGB7.1(DO) RGB8.3(DI)
N$109: RGB8.1(DO) RGB9.3(DI)
N$110: RGB9.1(DO) RGB10.3(DI)
N$111: RGB10.1(DO) RGB11.3(DI)
N$112: RGB11.1(DO) RGB12.3(DI)
N$113: RGB12.1(DO) RGB13.3(DI)
N$114: RGB13.1(DO) RGB14.3(DI)
N$115: RGB14.1(DO) RGB15.3(DI)
N$116: RGB15.1(DO) RGB16.3(DI)
N$117: R13.2 RGB1.3(DI)
R1: D1.C D22.C D23.C D24.C D25.C D26.C D27.C D28.C D29.C D30.C D31.C D32.C D33.C D36.C D65.C D70.C U1.3(P1.10) X2.6 X3.6 X7.6 X8.6
R2: D2.C D34.C D37.C D38.C D39.C D40.C D41.C D42.C D43.C D44.C D45.C D46.C D47.C D51.C D66.C D71.C U1.4(P1.13) X2.5 X3.5 X7.5 X8.5
R3: D3.C D48.C D49.C D50.C D52.C D53.C D54.C D55.C D56.C D57.C D58.C D59.C D60.C D61.C D67.C D72.C U1.5(P1.15) X2.4 X3.4 X7.4 X8.4
R4: D4.C D12.C D13.C D14.C D15.C D16.C D17.C D18.C D19.C D20.C D21.C D35.C D62.C D63.C D68.C D73.C U1.12(P0.04) X2.3 X3.3 X7.3 X8.3
R5: D5.C D6.C D7.C D8.C D9.C D10.C D11.C D64.C D69.C D74.C U1.29(P1.01) X2.2 X3.2 X7.2 X8.2
RST: S1.1 S1.2 U1.21(P0.18)
SCL: U1.51(P0.17)
SDA: U1.52(P0.15)
UG: R13.1 U1.35(P0.09)
UG_EN: R12.2 U1.36(P0.10)
UG_PWR: Q4.2(S) RGB1.4(VDD) RGB2.4(VDD) RGB3.4(VDD) RGB4.4(VDD) RGB5.4(VDD) RGB6.4(VDD) RGB7.4(VDD) RGB8.4(VDD) RGB9.4(VDD) RGB10.4(VDD) RGB11.4(VDD) RGB12.4(VDD) RGB13.4(VDD) RGB14.4(VDD) RGB15.4(VDD) RGB16.4(VDD) RGB17.4(VDD) RGB18.4(VDD)
VBAT: C1.2 Q1.3(BAT) Q2.3(D) R9.1 S3.2(P) USB_EXT.2
VBAT2: S3.1(O) USB_EXT.1 X4.2
VCC: D99.A F1.2 Q2.1(G) R7.2 U1.22(VBUS) USB_INT.2
VCCNRF: C2.2 J3.2(SCL) Q3.5(VOUT) Q4.3(D) R10.2 U1.14(VDD_NRF)
VSS: Q1.4(VCC) R5.2 USB_INT.1
VUSB: CHG.1 E1.5 F1.1 J1.A4B9(VBUS) J1.B4A9(VBUS) J4.4(VCC) X1.1 X4.6 X5.2
Unconnected: E1.3 E1.6 J1.A8(SBU1) J1.B8(SBU2) RGB18.1(DO) U1.38(P1.14) U1.39(P1.12) U1.40(P0.25) U1.41(P0.11) U1.42(P1.08) U1.43(P0.27) U1.44(P0.08) U1.45(P0.06) U1.46(P0.26) U1.47(P1.07) U1.48(P1.05) U1.49(P0.24) U1.50(P0.20) U1.53(P0.14) U1.54(P0.13) U1.55(P0.16)

## Library data of the parts
0 1-6 6.25U 7 7U 8 9 ' , - . .. / = =1-=5 [ \/ \\ ] A B BCKSPC C CAPS D DEL E ENTER F FN G H I J K L LALT LALT1 LCTRL LCTRL1 LSHIFT LSHIFT1 LWIN LWIN1 M N O P Q R RALT1 RCTRL RCTRL1 RSHIFT1 RSHIFT2 RWIN RWIN1-RWIN3 S STEPED T TAB TAB1-TAB4 U V W X Y Z | ~ ~1 = Keyboard:KEYSWITCH-PLAIN
BAT CHG = adafruit:JST_2PIN: JST 2-Pin Connectors of various flavors SMT-RA (S2B-PH-SM4) 4UConnector #17311 SMT (B2B-PH-SM4) THM-RA (S2B-PH) THM (B2B-PH)
C1-C3 = Components:CAPACITOR
D1-D74 D99 = Components:DIODE: Standard 1N4148 diode
E1 = SRV05-4.TCT:SRV05-4.TCT: Semtech SRV05-4.TCT, Uni-Directional TVS Diode Array, 300W, 6-Pin SOT-23 Source: Datasheet <https://componentsearchengine.com/Datasheets/1/SRV05-4.TCT.pdf> Check prices <https://pricing.snapeda.com/parts/SRV05-4.TC/Semtech/view-part?ref=eda>; AVAILABILITY: In Stock; DESCRIPTION: 17.5V Clamp 12A (8/20µs) Ipp Tvs Diode Surface Mount SOT-23-6; MF: Semtech; MP: SRV05-4.TC; PACKAGE: SOT-23-6 Semtech; PRICE: None; PURCHASE-URL: https://pricing.snapeda.com/search/part/SRV05-4.TC/?ref=eda
F1 = fuse:0ZCJ0075AF2E: PTC RESTTBLE 0.75A 16V CHIP 1206 Check prices <https://pricing.snapeda.com/parts/0ZCJ0075AF2E/Bel%20Fuse/view-part?ref=eda>; AVAILABILITY: In Stock; DESCRIPTION: 1206 SMT PPTC | 0.75 Ih | 16V; MF: Bel Fuse; MP: 0ZCJ0075AF2E; PACKAGE: 1206 Bel Fuse; PRICE: None; PURCHASE-URL: https://pricing.snapeda.com/search/part/0ZCJ0075AF2E/?ref=eda
J1 = TYPE-C-31-M-12:TYPE-C-31-M-12: USB Connectors 24 Receptacle 1 8.94*7.3mm RoHS; AVAILABILITY: Unavailable; DESCRIPTION: USB Connectors 24 Receptacle 1 8.94*7.3mm RoHS; MF: HRO Electronics Co., Ltd.; MP: TYPE-C-31-M-12; PACKAGE: Package; PRICE: None
J3 J4 = Headers:I2C-HEADER
JP1 = pinhead:PINHD-1X2: PIN HEADER
LED_CHG = adafruit:LED: LED OSRAM: - CHIPLED LG R971, LG N971, LY N971, LG Q971, LY Q971, LO R971, LY R971 LH N974, LH R974 LS Q976, LO Q976, LY Q976 LO Q996 - Hyper CHIPLED LW Q18S LB Q993, LB Q99A, LB R99A - SideLED LS A670, LO A670, LY A670, LG A670, LP A670 LB A673, LV A673, LT A673, LW A673 LH A674 LY A675 LS A676, LA A676, LO A676, LY A676, LW A676 LS A679, LY A679, LG A679 - Hyper Micro SIDELED® LS Y876, LA Y876, LO Y876, LY Y876 LT Y87S - SmartLED LW L88C, LW L88S LB L89C, LB L89S, LG L890 LS L89K, LO L89K, LY L89K LS L896, LA L896, LO L896, LY L896 - TOPLED LS T670, LO T670, LY T670, LG T670, LP T670 LSG T670, LSP T670, LSY T670, LOP T670, LYG T670 LG T671, LOG T671, LSG T671 LB T673, LV T673, LT T673, LW T673 LH T674 LS T676, LA T676, LO T676, LY T676, LB T676, LH T676, LSB T676, LW T676 LB T67C, LV T67C, LT T67C, LS T67K, LO T67K, LY T67K, LW E67C LS E67B, LA E67B, LO E67B, LY E67B, LB E67C, LV E67C, LT E67C LW T67C LS T679, LY T679, LG T679 LS T770, LO T770, LY T770, LG T770, LP T770 LB T773, LV T773, LT T773, LW T773 LH T774 LS E675, LA E675, LY E675, LS T675 LS T776, LA T776, LO T776, LY T776, LB T776 LHGB T686 LT T68C, LB T68C - Hyper Mini TOPLED® LB M676 - Mini TOPLED Santana® LG M470 LS M47K, LO M47K, LY M47K Source: http://www.osram.convergy.de/
Q1 = LTC4054:LTC4054: LTC4054 Li-ion Charger IC TSOT 5
Q2 Q4 = AO3401:AO3401: 30V N-Channel MOSFET The AO3404 uses advanced trench technology to provide excellent RDS(ON) and low gate charge. This device may be used as a load switch or in PWM applications. Maximum ratings: Drain-Source Voltage: 30V Gate-Source Voltage: +-20V Continuous Drain Current: 5 (25 C) / 4 (70 C) A Gate Threshold Voltage: 1.2 - 2.4 V Check availability <https://pricing.snapeda.com/parts/AO3401/Alpha%20%26%20Omega%20Semiconductor/view-part?ref=eda>; AVAILABILITY: In Stock; DESCRIPTION: P-Channel 30 V 4A (Ta) 1.4W (Ta) Surface Mount SOT-23-3; MF: Alpha & Omega Semiconductor; MP: AO3401; PACKAGE: SOT-23-3 Alpha &amp; Omega Semiconductor; PRICE: None
Q3 = AP2112K-3.3TRG1:AP2112K-3.3TRG1: AP2112 Series 0.6 A 3.3 V Fixed Output SMT LDO Linear Regulator - SOT23-5 Check availability <https://pricing.snapeda.com/parts/AP2112K-3.3TRG1/Diodes%20Inc./view-part?ref=eda>; AVAILABILITY: In Stock; DESCRIPTION: Linear Voltage Regulator IC Positive Fixed 1 Output 600mA SOT-25; MF: Diodes Inc.; MP: AP2112K-3.3TRG1; PACKAGE: SOT-753 Diodes Inc.; PRICE: None; PURCHASE-URL: https://pricing.snapeda.com/search/part/AP2112K-3.3TRG1/?ref=eda
Q5 = 2N7002:2N7002: N-Channel 60V 280mA (Ta) 350mW (Ta) Surface Mount SOT-23-3 (TO-236) Check prices <https://pricing.snapeda.com/parts/2N7002/ON%20Semiconductor/view-part?ref=eda>; AVAILABILITY: In Stock; DESCRIPTION: Mosfet Array 2 N-Channel (Dual) 60V 300mA 500mW Surface Mount PG-SOT363-6; MF: ON Semiconductor; MP: 2N7002; PACKAGE: SOT-23-3 ON Semiconductor; PRICE: None; PURCHASE-URL: https://pricing.snapeda.com/search/part/2N7002/?ref=eda
R1-R13 USB_EXT USB_INT = Components:RESISTOR
RGB1-RGB18 = WS2812-2020:WS2812-2020: Intelligent control LED integrated light source Check availability <https://pricing.snapeda.com/parts/WS2812-2020/Worldsemi/view-part?ref=eda>; AVAILABILITY: Not in stock; DESCRIPTION: Intelligent control LED light source, SMD-4; MF: Worldsemi; MP: WS2812-2020; PACKAGE: Package; PRICE: None
S1 = SparkFun-Switches:MOMENTARY-SWITCH-SPST: Momentary Switch (Pushbutton) - SPST Normally-open (NO) SPST momentary switches (buttons, pushbuttons). Variants PTH-12MM - 12mm square, through-hole Momentary Pushbutton Switch - 12mm Square <https://www.sparkfun.com/products/9190> (COM-09190) PTH-6.0MM, PTH-6.0MM-KIT - 6.0mm square, through-hole Mini Pushbutton Switch <https://www.sparkfun.com/products/97> (COM-00097) KIT package intended for soldering kit's - only one side of pads' copper is exposed. PTH-RIGHT-ANGLE-KIT - Right-angle, through-hole Right Angle Tactile Button <https://www.sparkfun.com/products/10791> - Used on SparkFun BigTime Watch Kit <https://www.sparkfun.com/products/11734> SMD-12MM - 12mm square, surface-mount Tactile Button - SMD (12mm) <https://www.sparkfun.com/products/12993> (COM-12993) Used on SparkFun PicoBoard <https://www.sparkfun.com/products/11888> SMD-4.5MM - 4.5mm Square Trackball Switch Used on SparkFun Blackberry Trackballer Breakout <https://www.sparkfun.com/products/13169> SMD-4.6MMX2.8MM - 4.60mm x 2.80mm, surface mount Used on SparkFun Pro Micro - RP2040 <https://www.sparkfun.com/products/17717> SMD-5.2MM, SMD-5.2-REDUNDANT - 5.2mm square, surface-mount Mini Pushbutton Switch - SMD <https://www.sparkfun.com/products/8720> (COM-08720) Used on Arduino Pro Mini <https://www.sparkfun.com/products/11114> REDUNDANT package connects both switch circuits together SMD-6.0X3.5MM - 6.0 x 3.5mm, surface mount Momentary Reset Switch SMD <https://www.sparkfun.com/products/8229> (COM-08229) SMD-6.2MM-TALL - 6.2mm square, surface mount Tactile Button - SMD (6mm) <https://www.sparkfun.com/products/12992> Used on SparkFun Digital Sandbox <https://www.sparkfun.com/products/12651> SMD-RIGHT-ANGLE - Right-angle, surface mount Used on SparkFun Block for Intel® Edison - Arduino <https://www.sparkfun.com/products/13036>; PROD_ID: SWCH-14139
S3 = SparkFun-Switches:SWITCH-SPDT: Single Pole, Double Throw (SPDT) Switch Single-pole, double-throw (SPDT) switch. Variant Overview SMD-AYZ0202 Surface Mount DPDT Switch <https://www.sparkfun.com/products/597> (COM-00597) Used on e.g. LilyPad Arduino USB - ATmega32U4 Board <https://www.sparkfun.com/products/12049> PTH-11.6X4.0MM SPDT Mini Power Switch <https://www.sparkfun.com/products/102> (COM-00102) Used on e.g. SparkFun Simon Says - Through-Hole Soldering Kit <https://www.sparkfun.com/products/10547> (KIT-10547) PTH-11.6X4.0MM-KIT KIT version of SPDT Mini Power Switch - Simplifies soldering by removing tStop of switch pins - only one side can be soldered. PTH-11.6X4.0MM-LOCK LOCK version of SPDT Mini Power Switch - Offset pins hold switch in place for easier soldering. SMD-RIGHT-ANGLE Surface Mount Right Angle Switch <https://www.sparkfun.com/products/10860> (COM-10860) Used on e.g. SparkFun ESP8266 Thing <https://www.sparkfun.com/products/13231>; PROD_ID: SWCH-08179; SF_ID: COM-00597
U1 = HOLYIOT-18010-NRF52840:HOLYIOT-18010-NRF52840: Holyiot_18010 is powerful, very flexible ultra-low power BLuetooth low energy (BLE module) using Nordic NRF52840 SoC, with ARM Cortex-M4 CPU, which has floating point unit (FPU), 1MB flash with cache and 256kb RAM, it offers a multitude of peripherals that include NFC, USB and multiple options interface including Quad SPI (QSPI). Check availability <https://pricing.snapeda.com/parts/HOLYIOT-18010-NRF52840/Holyiot/view-part?ref=eda>; AVAILABILITY: Not in stock; DESCRIPTION: Holyiot_18010 is powerful, very flexible ultra-low power BLuetooth low energy (BLE module) using Nordic NRF52840 SoC, with ARM Cortex-M4 CPU, which has floating point unit (FPU), 1MB flash with cache and 256kb RAM, it offers a multitude of peripherals that include NFC, USB and multiple options interface including Quad SPI (QSPI).; MF: Holyiot; MP: HOLYIOT-18010-NRF52840; PACKAGE: Package; PRICE: None
X1 = con-JST SH:SM04B-SRSS: JST SH series header 1.00mm pitch disconnectable crimp style connectors, horizontal (side entry type), 4 pins
X2-X4 X7 X8 = con-JST SH:BM06B-SRSS: JST SH series header 1.00mm pitch disconnectable crimp style connectors, vertical (side entry type), 6 pins
X5 X6 = con-JST SH:BM02B-SRSS: JST SH series header 1.00mm pitch disconnectable crimp style connectors, vertical (side entry type), 2 pins